# EasyEDA schematic 1-Schematic_SIT210_PCB.json
TITLE: Sheet_1; REV: 1.0; Date: 2021-05-30; Sheet: 1/1; Drawn By: nicolaAM; Company: Deakin University
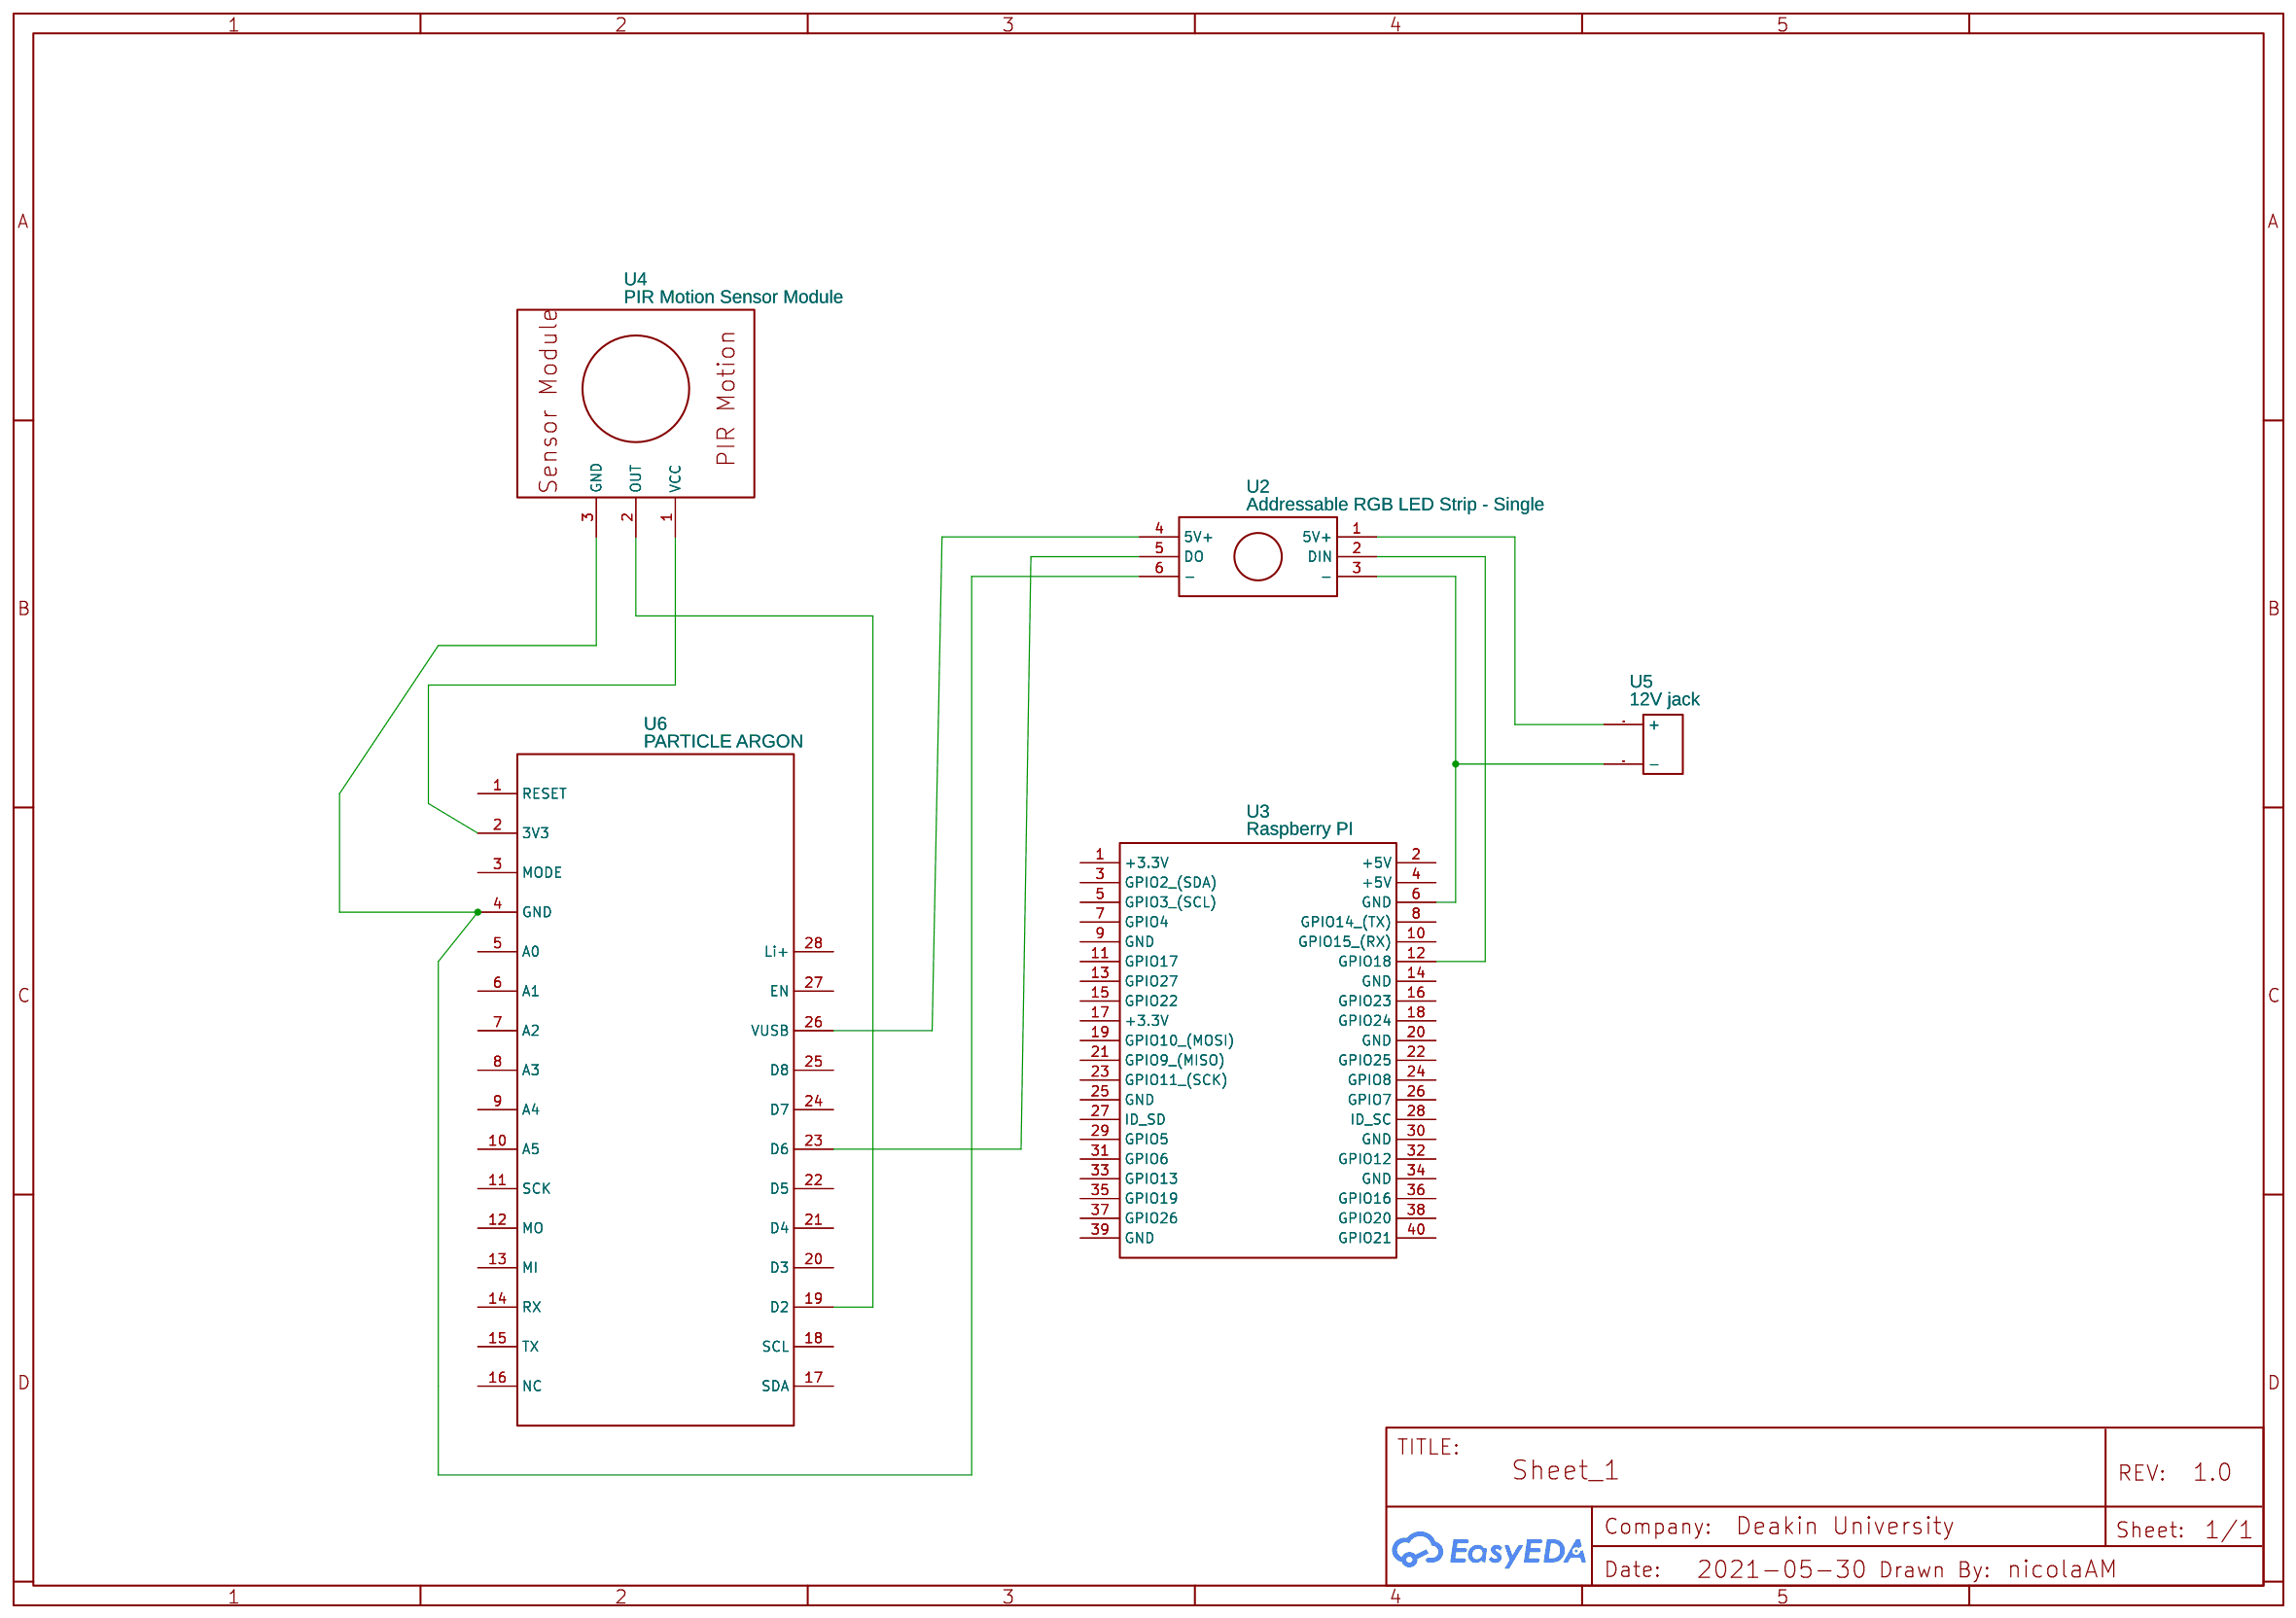
[diagram p0: schematic sheet]

## Parts
U2  Addressable RGB LED Strip - Single  [ADDRESSABLE RGB LED WS2812B]
U3  Raspberry PI  [RASPBERRY_PI_GPIO]
U4  PIR Motion Sensor Module  [PIRMOTIONSENSOR]
U5  12V jack  [12V JACK]
U6  PARTICLE ARGON  [PARTICLE_XENON]

## Library data of the parts
U2 = Addressable RGB LED Strip - Single: Contributor: Ricky Leorenta
U3 = Raspberry PI: Contributor: sami 18
U4 = PIR Motion Sensor Module: Contributor: Frank Drachman
U5 = 12V jack: Contributor: mossphuket
U6 = PARTICLE ARGON: Contributor: farm21

## Nets
Net-(U2-1): U2.1(5V+) U5.Vcc(+)
Net-(U2-2): U2.2(DIN) U3.12(GPIO18)
Net-(U2-3): U2.3(-) U3.6(GND) U5.GND(-)
Net-(U2-4): U2.4(5V+) U6.26(VUSB)
Net-(U2-5): U2.5(DO) U6.23(D6)
Net-(U2-6): U2.6(-) U4.3(GND) U6.4(GND)
Net-(U4-1): U4.1(VCC) U6.2(3V3)
Net-(U4-2): U4.2(OUT) U6.19(D2)

Not connected (* = marked no-connect by the designer): U3 1(+3.3V) 2(+5V) 3(GPIO2 (SDA)) 4(+5V) 5(GPIO3 (SCL)) 7(GPIO4) 8(GPIO14 (TX)) 9(GND) 10(GPIO15 (RX)) 11(GPIO17) 13(GPIO27) 14(GND) 15(GPIO22) 16(GPIO23) 17(+3.3V) 18(GPIO24) 19(GPIO10 (MOSI)) 20(GND) 21(GPIO9 (MISO)) 22(GPIO25) 23(GPIO11 (SCK)) 24(GPIO8) 25(GND) 26(GPIO7) 27(ID_SD) 28(ID_SC) 29(GPIO5) 30(GND) 31(GPIO6) 32(GPIO12) 33(GPIO13) 34(GND) 35(GPIO19) 36(GPIO16) 37(GPIO26) 38(GPIO20) 39(GND) 40(GPIO21); U6 1(RESET) 3(MODE) 5(A0) 6(A1) 7(A2) 8(A3) 9(A4) 10(A5) 11(SCK) 12(MO) 13(MI) 14(RX) 15(TX) 16(NC) 17(SDA) 18(SCL) 20(D3) 21(D4) 22(D5) 24(D7) 25(D8) 27(EN) 28(Li+)
